# EAGLE design StepStick-Protector_v10 (EAGLE 7.5.0)
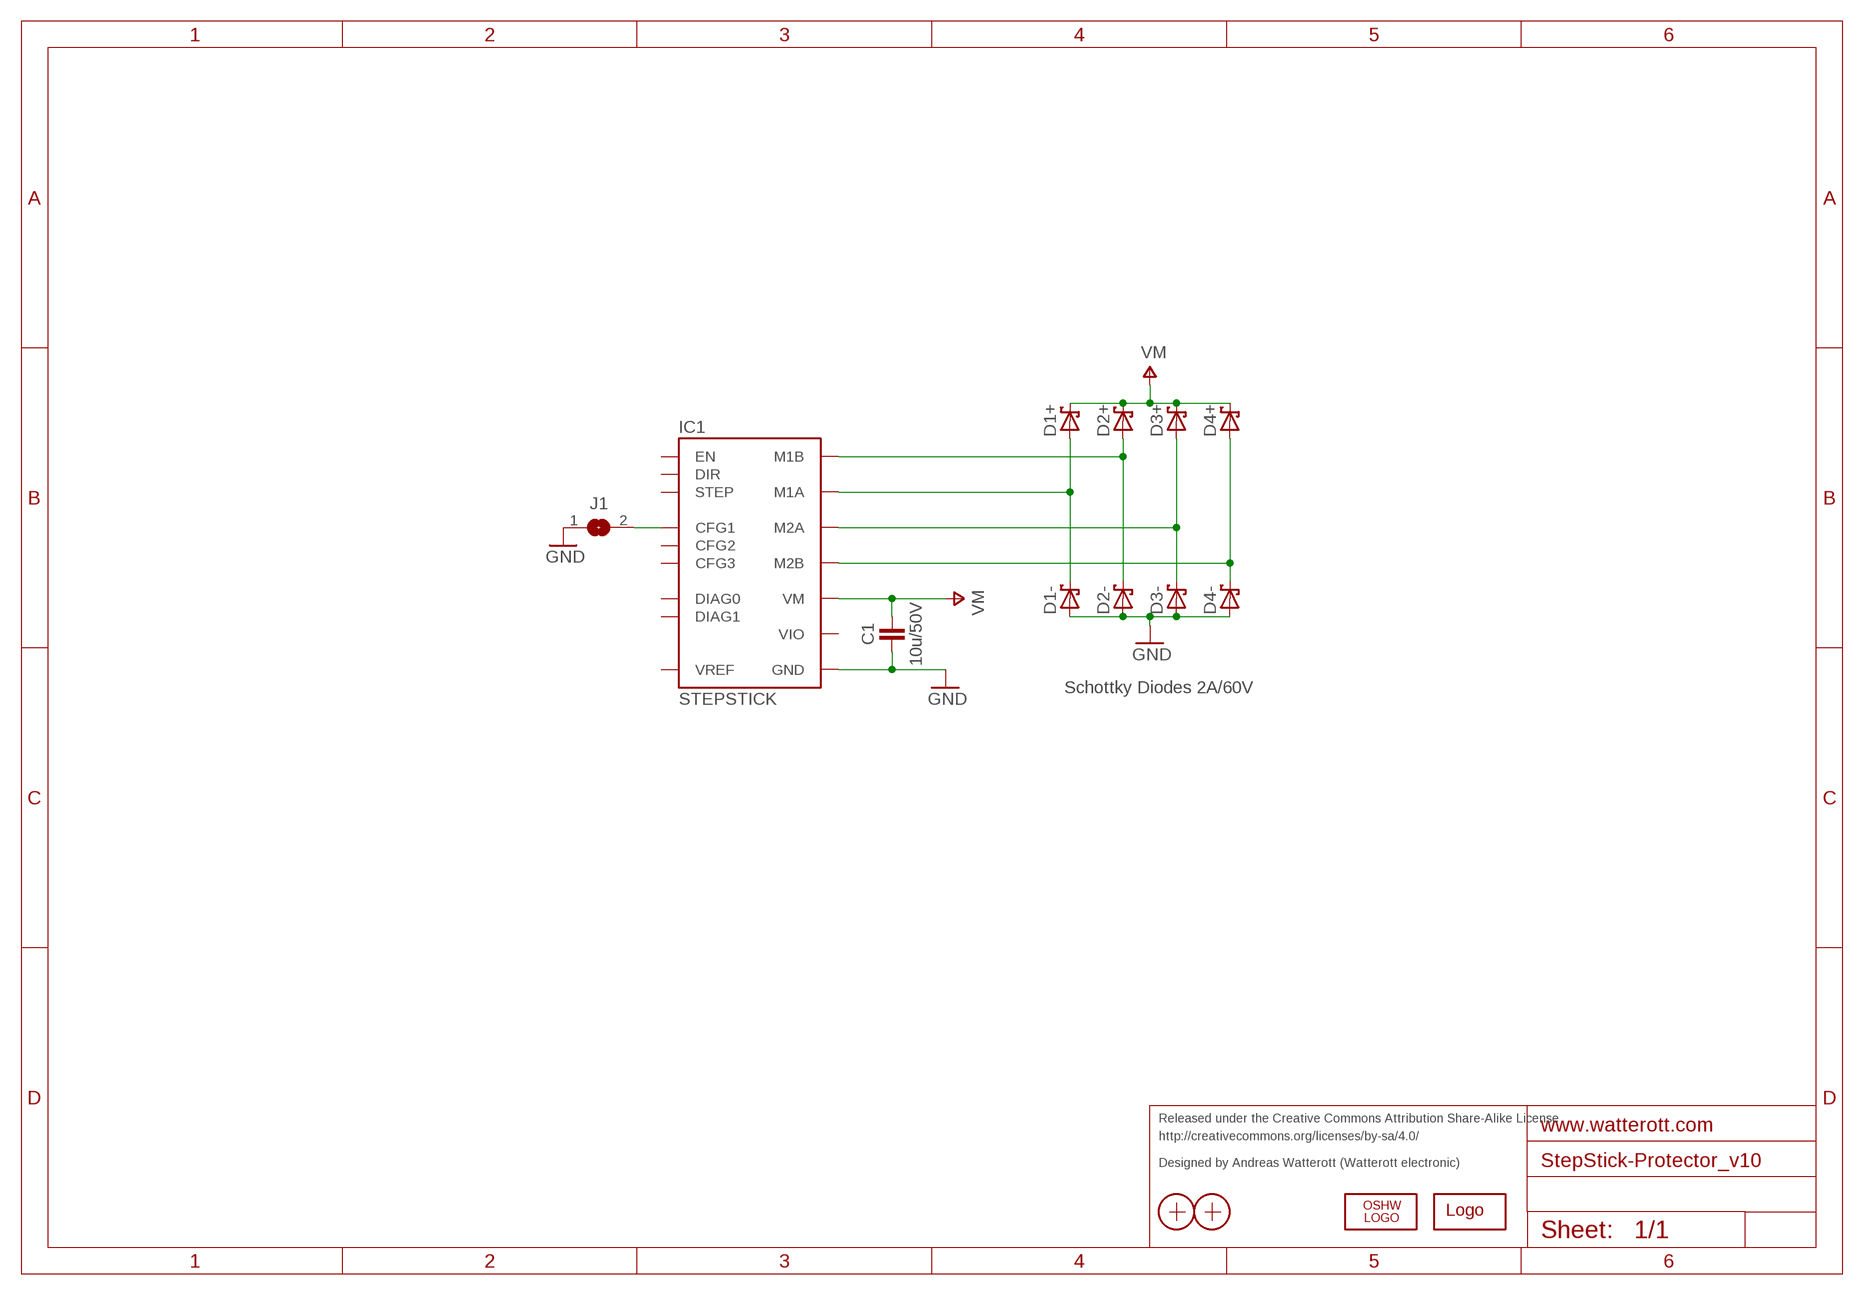
[diagram p0: schematic, sheet 1]

## Parts
C1  10u/50V  CAPACITOR-1210  [C1210]
D1+  D_SCHOTTKY-SS14  [SMA_DO214AC]
D1-  D_SCHOTTKY-SS14  [SMA_DO214AC]
D2+  D_SCHOTTKY-SS14  [SMA_DO214AC]
D2-  D_SCHOTTKY-SS14  [SMA_DO214AC]
D3+  D_SCHOTTKY-SS14  [SMA_DO214AC]
D3-  D_SCHOTTKY-SS14  [SMA_DO214AC]
D4+  D_SCHOTTKY-SS14  [SMA_DO214AC]
D4-  D_SCHOTTKY-SS14  [SMA_DO214AC]
IC1  STEPSTICK  [STEPSTICK]
J1  JUMPER2-0603-NC  [JUMPER2-0603_NC]
LOGO1  OSHW_LOGOX0070  [OSHW_6X70]
LOGO2  LOGO-S_PLACE_S  [SPARK_TPLACE_S]
X1  PASSER  [PASSER]
X2  PASSER  [PASSER]

## Nets
GND: C1.1 D1-.A D2-.A D3-.A D4-.A IC1.GND@1(GND) IC1.GND@2(GND) J1.1
M1A: D1+.A D1-.C IC1.M1A
M1B: D2+.A D2-.C IC1.M1B
M2A: D3+.A D3-.C IC1.M2A
M2B: D4+.A D4-.C IC1.M2B
N$1: IC1.CFG1 J1.2
VM: C1.2 D1+.C D2+.C D3+.C D4+.C IC1.VM
Unconnected: IC1.CFG2 IC1.CFG3 IC1.DIAG0 IC1.DIAG1 IC1.DIR IC1.EN IC1.STEP IC1.VREF

## Notes on the sheet
- Schottky Diodes 2A/60V
- Released under the Creative Commons Attribution Share-Alike License
- http://creativecommons.org/licenses/by-sa/4.0/
- Designed by Andreas Watterott (Watterott electronic)

## Power pins joined to a net without a drawn wire
VIO: IC1.VIO

## Library data of the parts
C1 = we-rcl:CAPACITOR: Capacitors ...4.7uF @ 6.3V -> 0402 ...10uF @ 16V -> 0603 ...22uF @ 25V -> 0805
D1+ D1- D2+ D2- D3+ D3- D4+ D4- = we-rcl:D_SCHOTTKY: Schottky Diodes
IC1 = we-board:STEPSTICK: SilentStepStick - TMC2100 Stepper Motor Driver
J1 = we-rcl:JUMPER2: 2 Pin Jumpers
LOGO1 = we-symbol:OSHW_LOGO: Open-Source-Hardware Logo
LOGO2 = we-symbol:LOGO: Watterott electronic Logo
X1 X2 = SMD:PASSER

## Board
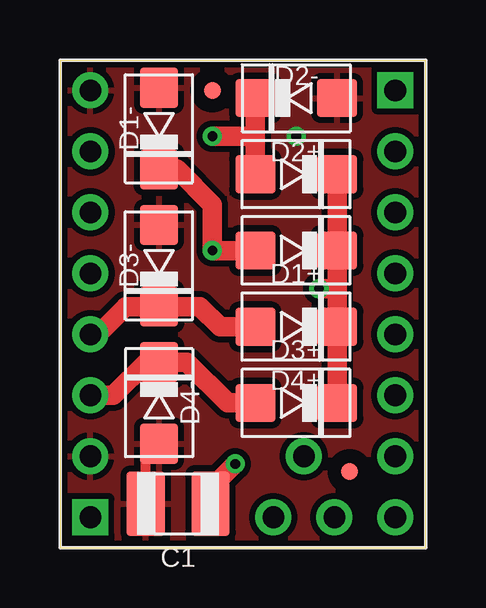
[diagram p1: board, top side]
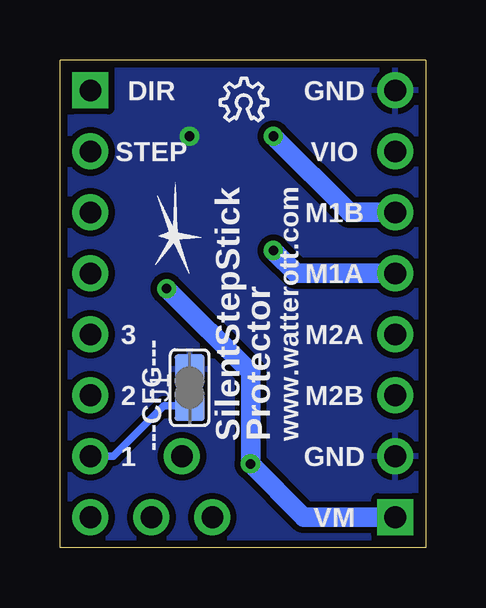
[diagram p2: board, bottom side, seen from below]

Size 15.24 x 20.32 mm. Coordinates in mm from the lower left corner, seen from the top.
Outline: 0,0 15.24,0 15.24,20.32 0,20.32 0,0
Copper layers (1*16): Top 0.035mm / dielectric 1.5mm / Bottom 0.035mm
Design rules "we-dru *": minimum track width 0.15mm, minimum drill 0.3mm, track to track 0.15mm, track to pad 0.15mm, pad to pad 0.15mm, via to via 0.15mm, smd to smd 0.1mm, copper to edge 0.3mm, drill to drill 0.2mm, minimum pad ring 0.18mm, minimum via ring 0.2mm, stop-mask expansion 0.1mm, vias tented up to drill 0.5mm, thermal gap 0.25mm

### Footprints (pad centres in the part's own frame; a part is rotated, then mirrored left to right if it is on the bottom)
C1210 = smd 2.7 x 1.6: 1 0,1.35; 2 0,-1.35
SMA_DO214AC = smd 1.6 x 1.68: A 0,-1.7; C 0,1.7
STEPSTICK = drill 0.9 pad 1.5: CFG1 -6.35,6.35; CFG2 -6.35,3.81; CFG3 -6.35,1.27; DIAG0 -2.54,6.35; DIAG1 -1.27,8.89; EN -6.35,8.89; GND@1 6.35,6.35; GND@2 6.35,-8.89; M1A 6.35,-1.27; M1B 6.35,-3.81; M2A 6.35,1.27; M2B 6.35,3.81; NC@1 -6.35,-3.81; NC@2 -6.35,-1.27; STEP -6.35,-6.35; VIO 6.35,-6.35; VREF -3.81,8.89 | drill 0.9 pad 1.5 square: DIR -6.35,-8.89; VM 6.35,8.89
JUMPER2-0603_NC = smd 1.25 x 1.25: 1 0,0.76; 2 0,-0.76
PASSER = smd 0.7 x 0.7: X 0,0

### Placement (x,y rotation side)
C1  4.92,1.83 90 top
D1+  9.84,12.38 270 top
D1-  4.13,17.46 180 top
D2+  9.84,15.56 270 top
D2-  9.84,18.73 90 top
D3+  9.84,9.21 270 top
D3-  4.13,11.75 180 top
D4+  9.84,6.03 270 top
D4-  4.13,6.03 0 top
IC1  7.62,10.16 180 top
J1  9.84,6.67 0 bottom
LOGO1  8.57,17.78 0 bottom
LOGO2  10.48,13.02 90 bottom
X1  12.06,3.17 0 top
X2  6.35,19.05 0 top

### Tracks (layer width: path | path; a pad name or v marks a point on that pad's centre or on a via)
GND  (via drill 0.4)
  Top 0.406: D4-.A 4.13,4.13 3.57,3.57 C1.1
  other vias: 9.84,17.14
  pour Bottom (isolate 0.254): 0,0 15.24,0 15.24,20.32 0,20.32
  pour Top (isolate 0.254): 0,0 15.24,0 15.24,20.32 0,20.32
M1A  (via drill 0.4)
  Top 0.813: D1+.A v6.35,12.38 6.35,14.29 4.88,15.76 D1-.C
  Bottom 0.813: IC1.M1A 5.4,11.43 v6.35,12.38
M1B  (via drill 0.4)
  Top 0.813: D2-.C 8.14,17.14 | 8.14,17.14 D2+.A | v6.35,17.14 8.14,17.14
  Bottom 0.813: IC1.M1B 3.17,13.97 v6.35,17.14
M2A
  Top 0.813: IC1.M2A 1.59,8.89 2.75,10.05 D3-.C 5.83,10.05 6.67,9.21 D3+.A
M2B
  Top 0.813: D4+.A 6.99,6.03 5.29,7.73 D4-.C 3.6,7.73 2.22,6.35 IC1.M2B
N$1
  Bottom 0.305: IC1.CFG1 13.02,3.81 10.92,5.91 J1.2
VM  (via drill 0.4)
  Top 0.813: D4+.C D3+.C 11.54,10.79 | 11.54,10.79 D1+.C D2+.C | v10.79,10.79 11.54,10.79 | C1.2 6.27,2.46 v7.3,3.49
  Bottom 0.813: IC1.VM 5.08,1.27 v7.3,3.49 7.3,7.3 v10.79,10.79

### Text on the board
bPlace: GND | DIR | VIO | STEP | M1B | M1A | M2A | 3 | M2B | ---CFG--- | 2 | GND | www.watterott.com | Protector | SilentStepStick | 1 | VM
Reference: Silkscreen: 22 bPlace